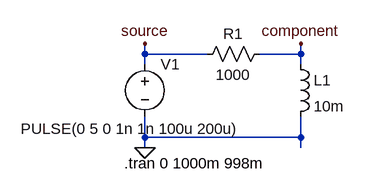
[diagram p0: schematic ltspice_simulation.asc]
ltspice_simulation.asc, the LTspice schematic file:
Version 4
SHEET 1 880 680
WIRE -80 -16 -80 -32
WIRE 16 -16 -80 -16
WIRE 160 -16 160 -32
WIRE 160 -16 96 -16
WIRE -80 0 -80 -16
WIRE 160 0 160 -16
WIRE -80 112 -80 80
WIRE 160 112 160 80
WIRE 160 112 -80 112
WIRE -80 128 -80 112
WIRE 160 128 160 112
FLAG -80 128 0
FLAG -80 -32 source
FLAG 160 -32 component
SYMBOL res 112 -32 R90
WINDOW 0 0 56 VBottom 2
WINDOW 3 32 56 VTop 2
SYMATTR InstName R1
SYMATTR Value 1000
SYMBOL voltage -80 -16 R0
WINDOW 123 0 0 Left 0
WINDOW 39 0 0 Left 0
WINDOW 3 -191 115 Left 2
SYMATTR Value PULSE(0 5 0 1n 1n 100u 200u)
SYMATTR InstName V1
SYMBOL ind 144 -16 R0
SYMATTR InstName L1
SYMATTR Value 10m
TEXT -112 152 Left 2 !.tran 0 1000m 998m

The netlist it stands for:
* ltspice_simulation.asc
R1 component source 1000
V1 source 0 PULSE(0 5 0 1n 1n 100u 200u)
L1 component 0 10m
.tran 0 1000m 998m
.backanno
.end